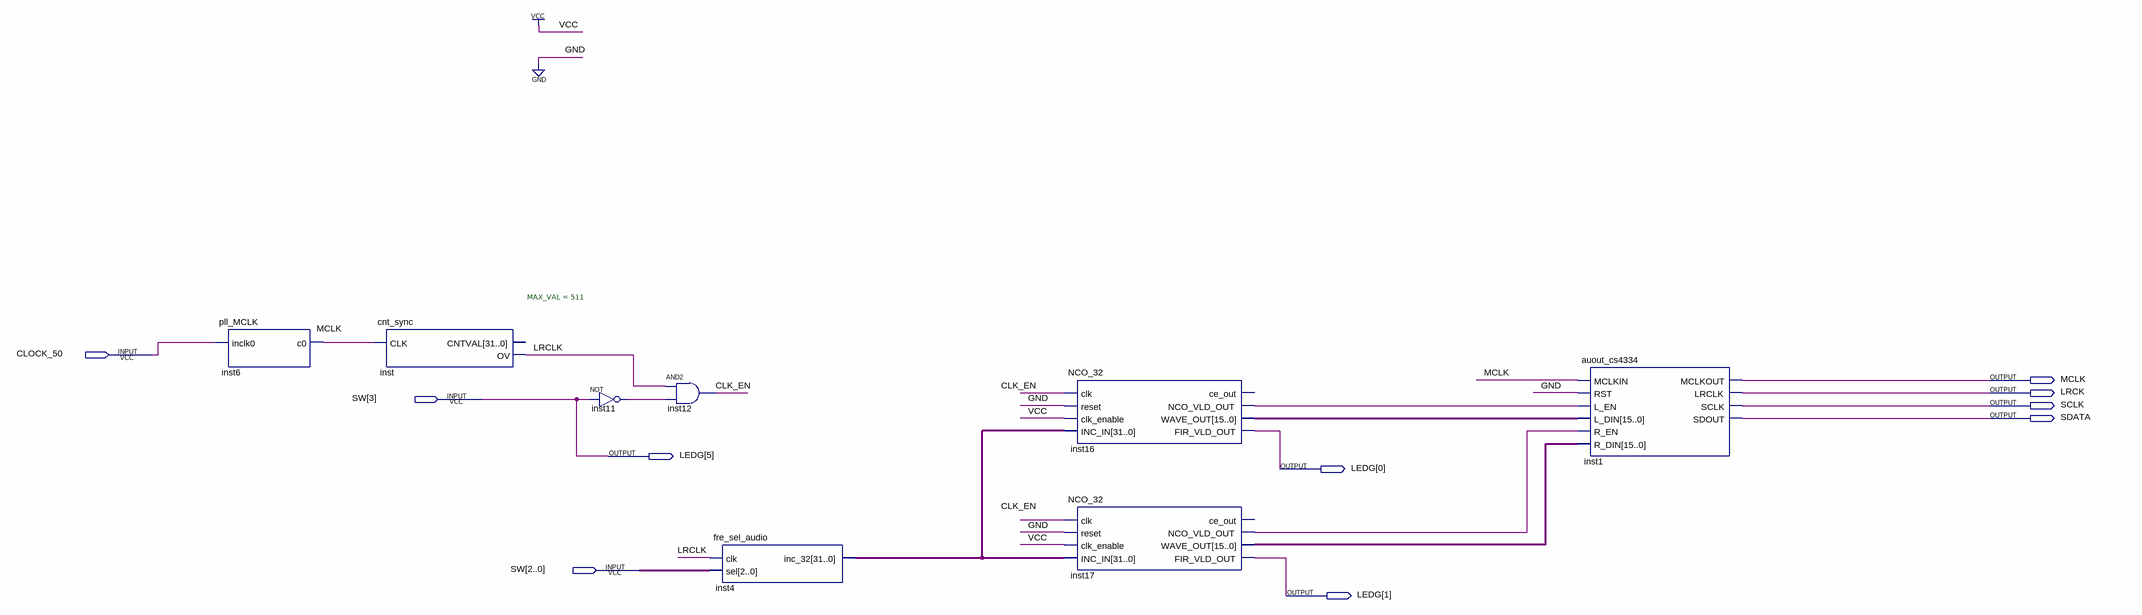
[diagram p0: schematic sheet]
// Quartus schematic i2s.bdf as structural Verilog: 8 symbols, 10 pins
module i2s (
  input  CLOCK_50,
  input  [3:0] SW,
  output MCLK,
  output LRCK,
  output SCLK,
  output SDATA,
  output [5:0] LEDG
);

  wire CLK_EN, inst11_out, inst16_nco_vld_out, inst17_nco_vld_out, LRCLK;
  wire [15:0] inst16_wave_out, inst17_wave_out;
  wire [31:0] inst4_inc_32;

  pll_MCLK inst6 (.inclk0(CLOCK_50), .c0(MCLK));
  cnt_sync #(.MAX_VAL(511)) inst (.CLK(MCLK), .OV(LRCLK));  // open: CNTVAL
  not inst11 (inst11_out, SW[3]);
  and inst12 (CLK_EN, LRCLK, inst11_out);
  fre_sel_audio inst4 (.clk(LRCLK), .sel(SW[2:0]), .inc_32(inst4_inc_32));
  NCO_32 inst16 (
    .clk(CLK_EN), .reset(1'b0), .clk_enable(1'b1), .INC_IN(inst4_inc_32), .NCO_VLD_OUT(inst16_nco_vld_out),
    .WAVE_OUT(inst16_wave_out), .FIR_VLD_OUT(LEDG[0]));  // open: ce_out
  NCO_32 inst17 (
    .clk(CLK_EN), .reset(1'b0), .clk_enable(1'b1), .INC_IN(inst4_inc_32), .NCO_VLD_OUT(inst17_nco_vld_out),
    .WAVE_OUT(inst17_wave_out), .FIR_VLD_OUT(LEDG[1]));  // open: ce_out
  auout_cs4334 inst1 (
    .MCLKIN(MCLK), .RST(1'b0), .L_EN(inst16_nco_vld_out), .L_DIN(inst16_wave_out), .R_EN(inst17_nco_vld_out),
    .R_DIN(inst17_wave_out), .MCLKOUT(MCLK), .LRCLK(LRCK), .SCLK(SCLK), .SDOUT(SDATA));

  assign LEDG[5] = SW[3];
endmodule
